# Altium schematic sheet Motor_Driver.SchDoc: Single Motor Driver
size A4; DrawnBy: Samyar Sadat Akhavi; Revision: 1.0; SheetNumber: 4; SheetTotal: 5; SPICEModelCacheJDKEGQXN: <root> / <DocumentId>JDKEGQXN</DocumentId> / </root>
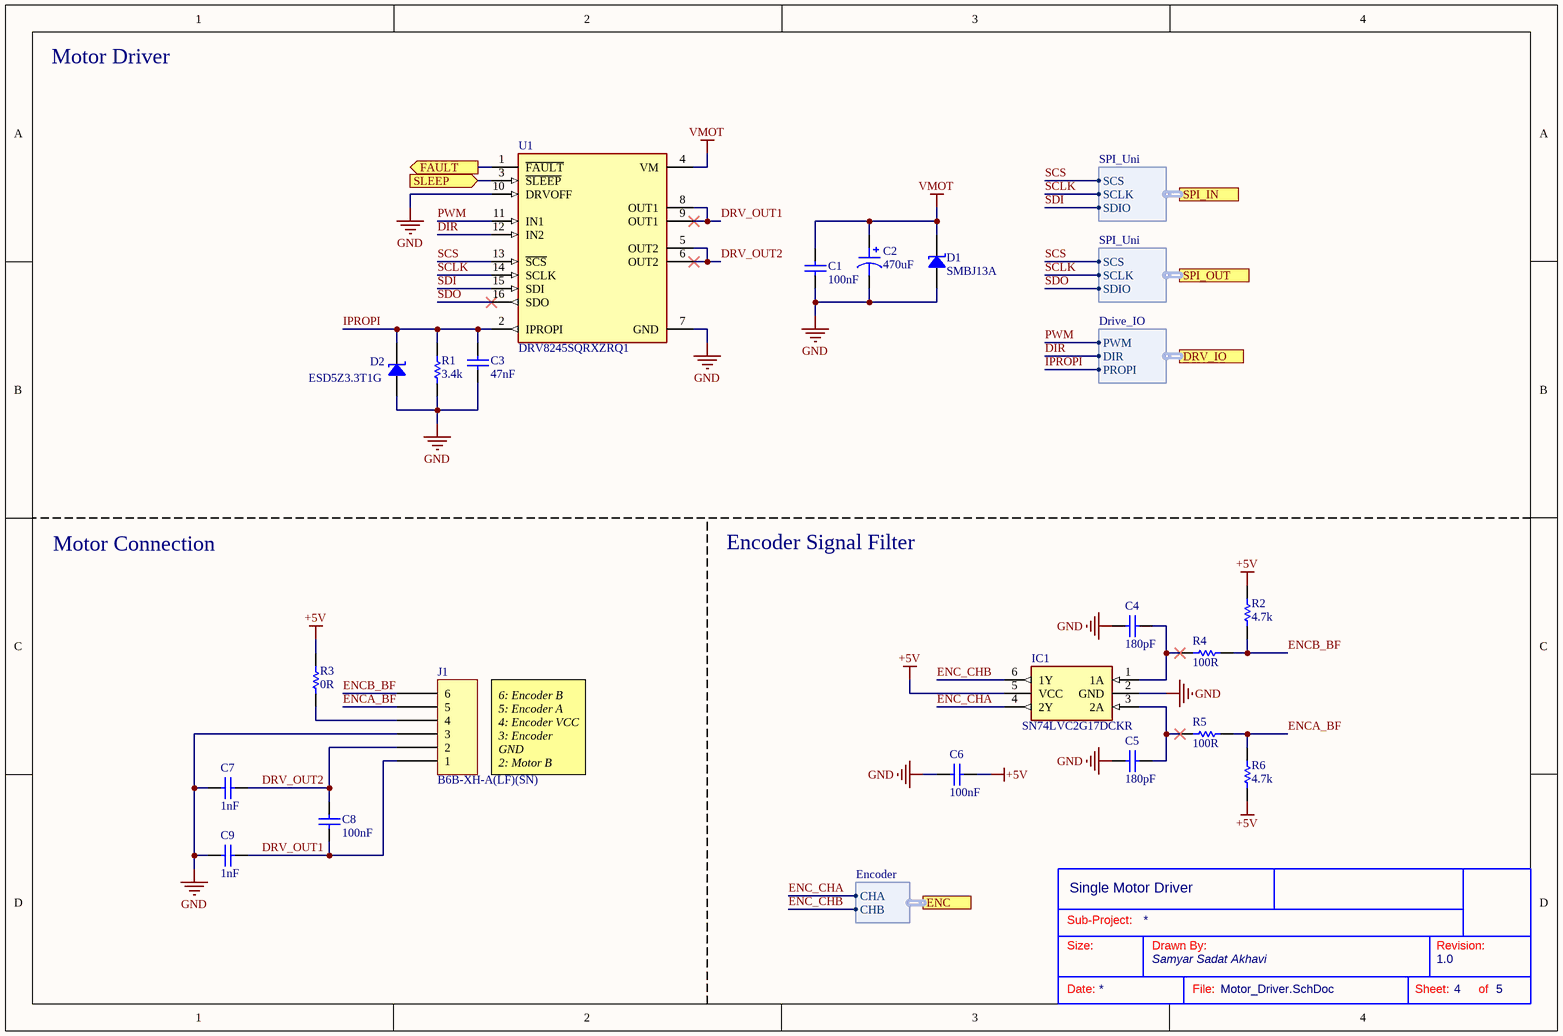
[diagram p0: Motor_Driver.SchDoc]

## Parts
?  (no value)  (graphical)
C1  100nF  [CAP_SMD_603]
C2  470uF  [CAP TH ALUM ELEC D8.00mm S3.50mm H11.50mm]
C3  47nF  [CAP_SMD_603]
C4  180pF  [CAP_SMD_603]
C5  180pF  [CAP_SMD_603]
C6  100nF  [CAP_SMD_603]
C7  1nF  [CAP_SMD_603]
C8  100nF  [CAP_SMD_1206]
C9  1nF  [CAP_SMD_603]
D1  SMBJ13A  [DO214AA SMB]
D2  ESD5Z3.3T1G  [SOD523F]
IC1  SN74LVC2G17DCKR  [SOP65P210X110-6N]
J1  B6B-XH-A(LF)(SN)  [JST XH B6B-XH-A]
R1  3.4k  [RES_0603]
R2  4.7k  [RES_0603]
R3  0R  [RES_0603]
R4  100R  [RES_0603]
R5  100R  [RES_0603]
R6  4.7k  [RES_0603]
U1  DRV8245SQRXZRQ1  [RXZ0016A-MFG]

## Ports
DRV_IO (harness Drive_IO, see Motor_Control_Board[4A]), ENC (harness Encoder, see Motor_Control_Board[4A]), FAULT (out, see Motor_Control_Board[4A]), SLEEP (in, see Motor_Control_Board[4A]), SPI_IN (harness SPI_Uni, see Motor_Control_Board[4A]), SPI_OUT (harness SPI_Uni, see Motor_Control_Board[4A])

## Harnesses
Encoder: CHA, CHB
Drive_IO: PWM, DIR, PROPI
SPI_Uni: SCS, SCLK, SDIO

## Nets
+5V: C6.2 IC1.5(VCC) R2.1 R3.1 R6.2
GND: C1.1 C2.2 C3.1 C4.2 C5.2 C6.1 C7.2 C9.2 D1.1 D2.1 IC1.2(GND) J1.3 R1.1 U1.7(GND) U1.10(DRVOFF)
VMOT: C1.2 C2.1 D1.2 U1.4(VM)
DIR: U1.12(IN2) ; port DRV_IO.DIR
DRV_OUT1: C8.1 C9.1 J1.1 U1.8(OUT1) U1.9(OUT1)
DRV_OUT2: C7.1 C8.2 J1.2 U1.5(OUT2) U1.6(OUT2)
ENC_CHA: IC1.4(2Y) ; port ENC.CHA
ENC_CHB: IC1.6(1Y) ; port ENC.CHB
ENCA_BF: J1.5 R5.1 R6.1
ENCB_BF: J1.6 R2.2 R4.1
FAULT: U1.1(~{FAULT}) ; port FAULT
IPROPI: C3.2 D2.2 R1.2 U1.2(IPROPI) ; port DRV_IO.PROPI
PWM: U1.11(IN1) ; port DRV_IO.PWM
SCLK: U1.14(SCLK) ; port SPI_IN.SCLK, port SPI_OUT.SCLK
SCS: U1.13(~{SCS}) ; port SPI_IN.SCS, port SPI_OUT.SCS
SDI: U1.15(SDI) ; port SPI_IN.SDIO
SDO: U1.16(SDO) ; port SPI_OUT.SDIO
SLEEP: U1.3(~{SLEEP}) ; port SLEEP
NetC4_1: C4.1 IC1.1(1A) R4.2
NetC5_1: C5.1 IC1.3(2A) R5.2
NetJ1_4: J1.4 R3.2

## Notes on the sheet
- Motor Driver
- Motor Connection
- Encoder Signal Filter
- 6: Encoder B
  5: Encoder A
  4: Encoder VCC
  3: Encoder GND
  2: Motor B
  1: Motor A
- Sub-Project:
- Size:
- Drawn By:
- Revision:
- Date:
- File:
- Sheet:
- of

## Library data of the parts
? = Standard Title Block
C1 = Non-polar Capacitor: Generic Ceramic Capacitor; Voltage: 25V; Value: 100nF
C2 = UVR1C471MPD1TA: CAP ALUM 470UF 20% 16V RADIAL; manufacturer: Nichicon; Lifetime @ Temp.: 2000 Hrs @ 85°C; Polarization: Polar; Ripple Current @ High Frequency: 660mA @ 10kHz; Ripple Current @ Low Frequency: 440mA @ 120Hz; Part Number: UVR1C471MPD1TA; Applications: General Purpose; Capacitance: 470uF; componentlink1description: Datasheet; componentlink1url: http://nichicon-us.com/english/products/pdfs/e-uvr.pdf; componentlink2description: DigiKey Link; componentlink2url: http://digikey.com/product-detail/en/nichicon/UVR1C471MPD1TA/UVR1C471MPD1TA-ND/2428037; Device Package: Radial, Can; Height - Seated (Max): 0.453" (11.50mm); lastupdated: 9/7/2020 5:24:50 AM; Lead Spacing: 0.138" (3.50mm); Lifecycle Status: Active; Minimum Order: 1000; Mounting Type: Through Hole; Operating Temperature: -40°C ~ 85°C; Package / Case: Radial, Can; packaging: TapeAndBox; partid: 23595; Part Status: Active; price: 0.08; series: UVR; Size / Dimension: 0.315" Dia (8.00mm); Supplier 1: DigiKey; Supplier Part Number 1: UVR1C471MPD1TA-ND; Tolerance: ±20%; value: 470uF; Voltage - Rated: 16V
C3-C6 = Non-polar Capacitor: Generic Ceramic Capacitor; Voltage: 6.3V
  C3: Value: 47nF
  C4 C5: Value: 180pF
  C6: Value: 100nF
C7-C9 = Non-polar Capacitor: Generic Ceramic Capacitor; Voltage: 100V
  C7 C9: Value: 1nF
  C8: Value: 100nF
D1 = SMBJ13A: TVS DIODE 13VWM 21.5VC SMB; Manufacturer: Bourns Inc.; Current - Peak Pulse (10/1000µs): 28A; Power Line Protection: No; Power - Peak Pulse: 600W; Type: Zener; Unidirectional Channels: 1; Voltage - Breakdown (Min): 14.4V; Voltage - Clamping (Max) @ Ipp: 21.5V; Voltage - Reverse Standoff (Typ): 13V; Part Number: SMBJ13A; Applications: General Purpose; ComponentLink1Description: Datasheet; ComponentLink1URL: https://www.bourns.com/docs/Product-Datasheets/SMBJ.pdf; ComponentLink2Description: DigiKey Link; ComponentLink2URL: https://www.digikey.com/en/products/detail/bourns-inc/SMBJ13A/2254626; LastUpdated: 6/3/2024 7:56:38 PM; Lifecycle Status: Active; Minimum Order: 1; Mounting Type: Surface Mount; Operating Temperature: -55°C ~ 150°C (TJ); Package / Case: DO-214AA, SMB; Packaging: TapeAndReel; PartId: 10876; Part Status: Active; Price: 0.08; Series: SMBJ; Supplier 1: DigiKey; Supplier Part Number 1: SMBJ13ABCT-ND; Supplier Device Package: DO-214AA (SMB)
D2 = ESD5Z3.3T1G: TVS DIODE 3.3V 14.1V SOD523; Manufacturer: ON Semiconductor; Capacitance @ Frequency: 105pF @ 1MHz; Current - Peak Pulse (10/1000µs): 11.2A (8/20µs); Power Line Protection: No; Power - Peak Pulse: 158W; Type: Zener; Unidirectional Channels: 1; Voltage - Breakdown (Min): 5V; Voltage - Reverse Standoff (Typ): 3.3V (Max); Part Number: ESD5Z3.3T1G; Applications: General Purpose; ComponentLink1Description: Datasheet; ComponentLink1URL: https://www.onsemi.com/pub/Collateral/ESD5Z2.5T1-D.PDF; ComponentLink2Description: DigiKey Link; ComponentLink2URL: http://digikey.com/product-detail/en/on-semiconductor/ESD5Z3.3T1G/ESD5Z3.3T1GOSCT-ND/1967044; LastUpdated: 6/3/2024 8:22:18 PM; Lifecycle Status: Active; Minimum Order: 1; Mounting Type: Surface Mount; Operating Temperature: -55°C ~ 150°C (TJ); Package / Case: SC-79, SOD-523; Packaging: TapeAndReel; PartId: 9754; Part Status: Active; Price: 0.04; Series: -; Supplier 1: DigiKey; Supplier Part Number 1: ESD5Z3.3T1GOSCT-ND; Supplier Device Package: SOD-523; Voltage - Clamping (Max) @ Ipp: 14.1V
IC1 = SN74LVC2G17DCKR: Integrated Circuit; Manufacturer_Name: Texas Instruments; Datasheet Link: http://www.ti.com/general/docs/suppproductinfo.tsp?distId=26&gotoUrl=http%3A%2F%2Fwww.ti.com%2Flit%2Fgpn%2Fsn74lvc2g17; Height: 1.1mm; Manufacturer_Part_Number: SN74LVC2G17DCKR; Mouser Part Number: 595-SN74LVC2G17DCKR; Mouser Price/Stock: https://www.mouser.co.uk/ProductDetail/Texas-Instruments/SN74LVC2G17DCKR?qs=spW5eSrOWB6kZFcYtrLxUQ%3D%3D; Arrow Part Number: SN74LVC2G17DCKR; Arrow Price/Stock: https://www.arrow.com/en/products/sn74lvc2g17dckr/texas-instruments?utm_currency=USD&region=europe
J1 = B6B-XH-A(LF)(SN): CONN HEADER VERT 6POS 2.5MM; Manufacturer: JST Sales America Inc.; Contact Length - Post: 0.134" (3.40mm); Current Rating (Amps): 3A; Material Flammability Rating: UL94 V-0; Number of Positions: 6; Number of Positions Loaded: All; Pitch - Mating: 0.098" (2.50mm); Shrouding: Shrouded - 4 Wall; Style: Board to Cable/Wire; Voltage Rating: 250V; System: Connector; Part Number: B6B-XH-A(LF)(SN); ComponentLink1Description: Datasheet; ComponentLink1URL: http://www.jst-mfg.com/product/pdf/eng/eXH.pdf; ComponentLink2Description: DigiKey Link; ComponentLink2URL: http://digikey.com/product-detail/en/jst-sales-america-inc/B6B-XH-A-LF-SN/455-2271-ND/1000381; Connector Type: Header; Contact Finish - Mating: Tin; Contact Finish - Post: Tin; Contact Material: Brass; Contact Shape: Square; Contact Type: Male Pin; Fastening Type: Detent Lock; Insulation Color: Natural; Insulation Height: 0.276" (7.00mm); Insulation Material: Polyamide (PA66), Nylon 6/6; LastUpdated: 1/12/2020 11:46:58 PM; Lifecycle Status: Active; Minimum Order: 1; Mounting Type: Through Hole; Number of Rows: 1; Operating Temperature: -25°C ~ 85°C; Packaging: Bulk; PartId: 71; Part Status: Active; Price: 0.27; Series: XH; Supplier 1: DigiKey; Supplier Part Number 1: 455-2271-ND; Termination: Press-Fit, Solder
R1 R2 R4-R6 = Resistor: Power: 1/8W
  R1: Value: 3.4k
  R2 R6: Value: 4.7k
  R4 R5: Value: 100R
R3 = Resistor: Value: 0R; Power: N/A
U1 = DRV8245SQRXZRQ1: Automotive 40-V, 32-A H-Bridge driver with integrated current sensing and feedback 16-VQFN-HR -40 to 125; Manufacturer_Name: Texas Instruments; TYPE: TYPE; RefDes: RefDes; Copyright: Copyright (C) 2025 Ultra Librarian. All rights reserved.; Manufacturer_Part_Number: DRV8245SQRXZRQ1